# Altium schematic sheet Memory.SchDoc
size A4
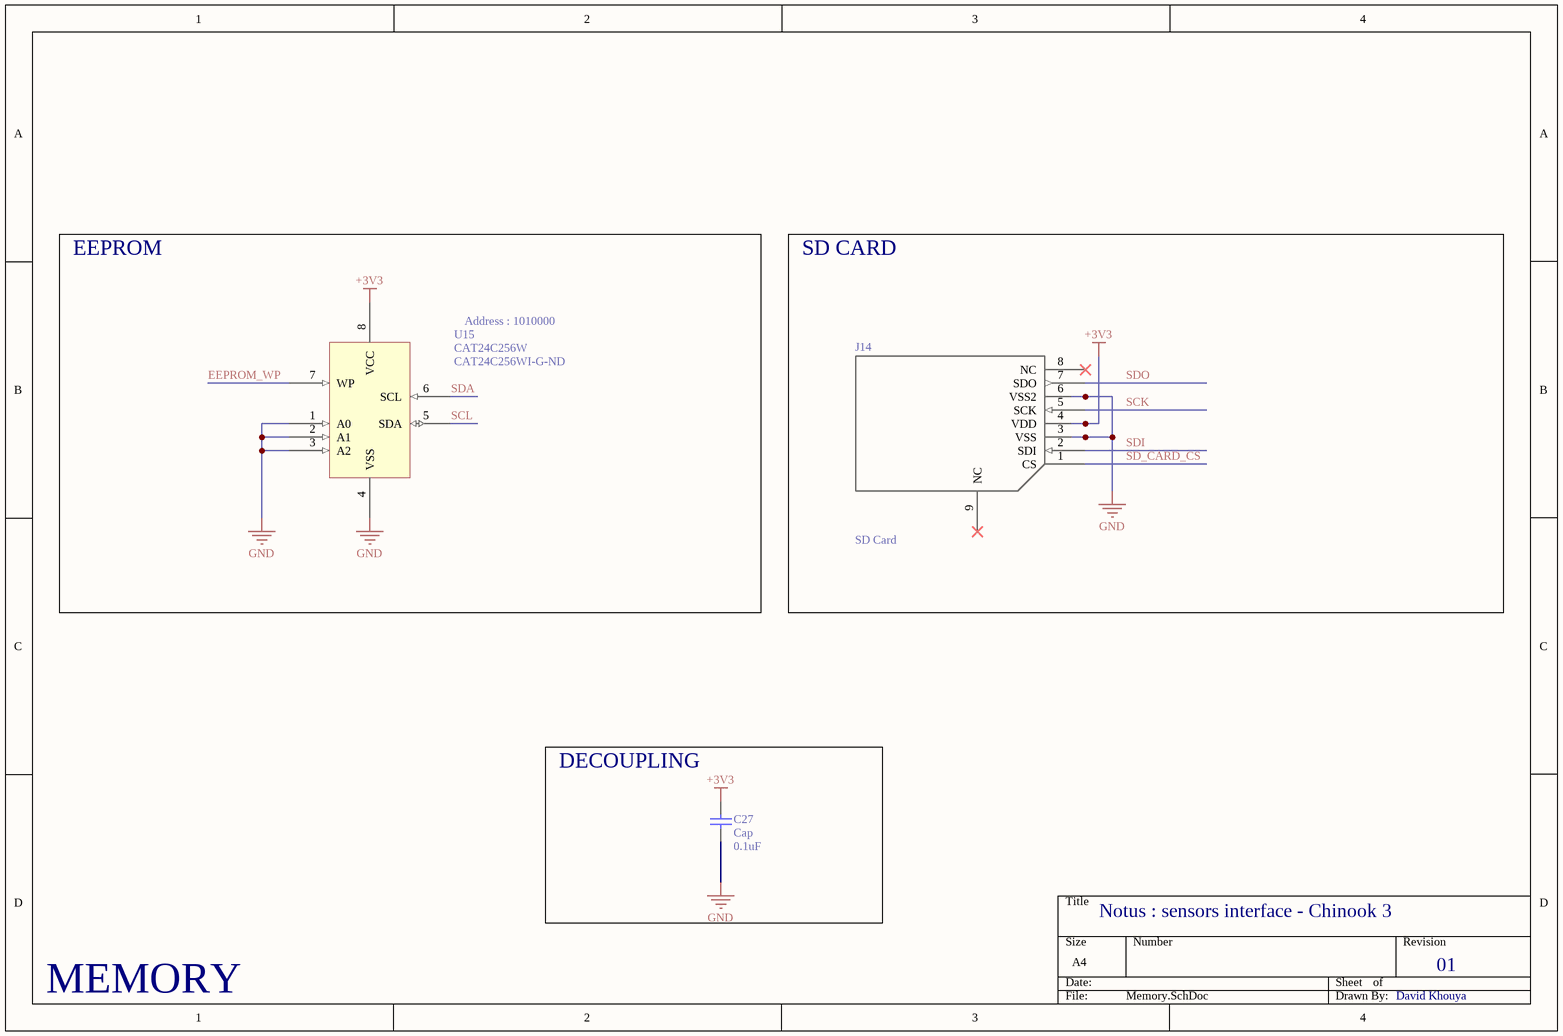
[diagram p0: Memory.SchDoc]

## Parts
C27  Cap  value 0.1uF  [RESC2012N]
J14  SD Card  [SD Card]
U15  CAT24C256W  Supplier Part Number 1: CAT24C256WI-G-ND  [8SOIC-2]

## Blocks framed on the sheet
EEPROM: U15
SD CARD: J14
DECOUPLING: C27

## Nets
+3V3: C27.2 J14.4(VDD) U15.8(VCC)
GND: C27.1 J14.3(VSS) J14.6(VSS2) U15.1(A0) U15.2(A1) U15.3(A2) U15.4(VSS)
EEPROM_WP: U15.7(WP)
SCK: J14.5(SCK)
SCL: U15.5(SDA)
SD_CARD_CS: J14.1(CS)
SDA: U15.6(SCL)
SDI: J14.2(SDI)
SDO: J14.7(SDO)

Not connected (* = marked no-connect by the designer): J14 8(NC)* 9(NC)*

## Notes on the sheet
- Address : 1010000
- Notus : sensors interface - Chinook 3
- 01
- MEMORY
- David Khouya

## Library data of the parts
C27 = Cap: Capacitor; Published: 8-Jun-2000; LatestRevisionDate: 17-Jul-2002; LatestRevisionNote: Re-released for DXP Platform.; PackageReference: RAD-0.3; Publisher: Altium Limited; PackageDescription: Radial Cap, Thru-Hole; 2 Leads; 0.3 in Pin Spacing
J14 = SD Card: SPI Sd card connector pinout
U15 = CAT24C256W: 256 kb I2C CMOS Serial  EEPROM; Supplier 1: Digi-Key